# EAGLE schematic X16-Backplane (EAGLE 9.6.2)

## Sheet 1 of 2
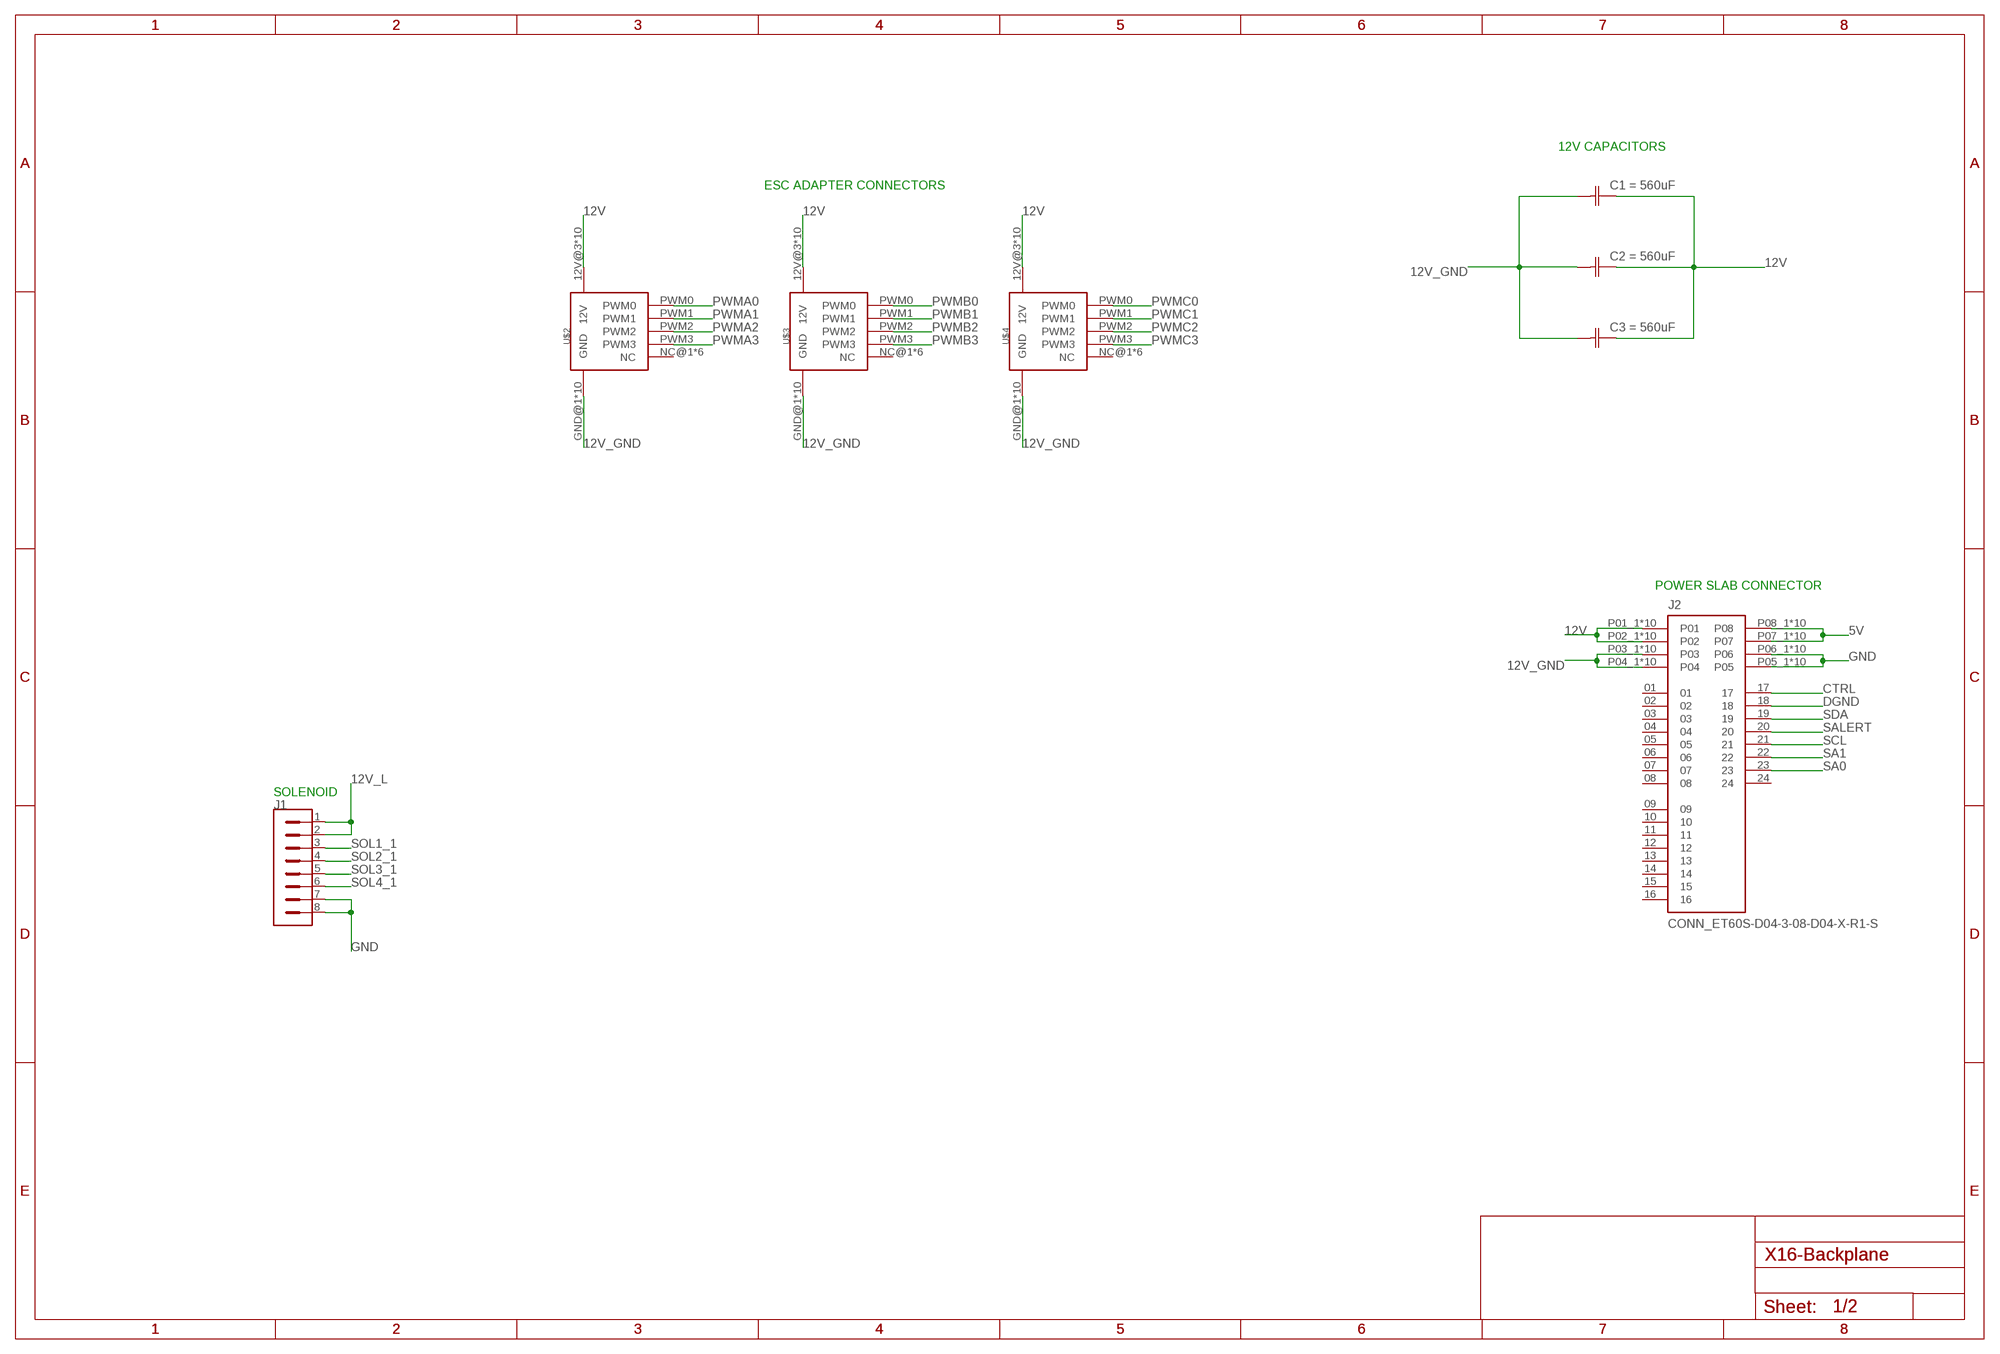
[diagram p0: schematic, sheet 1]

### Parts
C1  EEE-FT1E561UP  [CAP_FT_F_PAN]
C2  EEE-FT1E561UP  [CAP_FT_F_PAN]
C3  EEE-FT1E561UP  [CAP_FT_F_PAN]
J1  CONN_PXC-8-RA-1778683  [PXC-8-RA-1778683]
J2  CONN_ET60S-D04-3-08-D04-X-R1-S  [SAMTEC_ET60S-D04-3-08-D04-X-R1-S]
U$2  CONN_BACKPLANE_ESC_ADAPTER  [CONN_BACKPLANE_ESC_ADAPTER]
U$3  CONN_BACKPLANE_ESC_ADAPTER  [CONN_BACKPLANE_ESC_ADAPTER]
U$4  CONN_BACKPLANE_ESC_ADAPTER  [CONN_BACKPLANE_ESC_ADAPTER]

### Nets
5V: J2.P07_1(P07) J2.P07_2(P07) J2.P07_3(P07) J2.P07_4(P07) J2.P07_5(P07) J2.P07_6(P07) J2.P07_7(P07) J2.P07_8(P07) J2.P07_9(P07) J2.P07_10(P07) J2.P08_1(P08) J2.P08_2(P08) J2.P08_3(P08) J2.P08_4(P08) J2.P08_5(P08) J2.P08_6(P08) J2.P08_7(P08) J2.P08_8(P08) J2.P08_9(P08) J2.P08_10(P08) ; also sheet 2
12V: C1.1 C2.1 C3.1 J2.P01_1(P01) J2.P01_2(P01) J2.P01_3(P01) J2.P01_4(P01) J2.P01_5(P01) J2.P01_6(P01) J2.P01_7(P01) J2.P01_8(P01) J2.P01_9(P01) J2.P01_10(P01) J2.P02_1(P02) J2.P02_2(P02) J2.P02_3(P02) J2.P02_4(P02) J2.P02_5(P02) J2.P02_6(P02) J2.P02_7(P02) J2.P02_8(P02) J2.P02_9(P02) J2.P02_10(P02) U$2.12V@3(12V) U$2.12V@4(12V) U$2.12V@5(12V) U$2.12V@6(12V) U$2.12V@7(12V) U$2.12V@8(12V) U$2.12V@9(12V) U$2.12V@10(12V) U$2.12V@11(12V) U$2.12V@12(12V) U$3.12V@3(12V) U$3.12V@4(12V) U$3.12V@5(12V) U$3.12V@6(12V) U$3.12V@7(12V) U$3.12V@8(12V) U$3.12V@9(12V) U$3.12V@10(12V) U$3.12V@11(12V) U$3.12V@12(12V) U$4.12V@3(12V) U$4.12V@4(12V) U$4.12V@5(12V) U$4.12V@6(12V) U$4.12V@7(12V) U$4.12V@8(12V) U$4.12V@9(12V) U$4.12V@10(12V) U$4.12V@11(12V) U$4.12V@12(12V) ; also sheet 2
12V_GND: C1.2 C2.2 C3.2 J2.P03_1(P03) J2.P03_2(P03) J2.P03_3(P03) J2.P03_4(P03) J2.P03_5(P03) J2.P03_6(P03) J2.P03_7(P03) J2.P03_8(P03) J2.P03_9(P03) J2.P03_10(P03) J2.P04_1(P04) J2.P04_2(P04) J2.P04_3(P04) J2.P04_4(P04) J2.P04_5(P04) J2.P04_6(P04) J2.P04_7(P04) J2.P04_8(P04) J2.P04_9(P04) J2.P04_10(P04) U$2.GND@1(GND) U$2.GND@2(GND) U$2.GND@3(GND) U$2.GND@4(GND) U$2.GND@5(GND) U$2.GND@6(GND) U$2.GND@7(GND) U$2.GND@8(GND) U$2.GND@9(GND) U$2.GND@10(GND) U$3.GND@1(GND) U$3.GND@2(GND) U$3.GND@3(GND) U$3.GND@4(GND) U$3.GND@5(GND) U$3.GND@6(GND) U$3.GND@7(GND) U$3.GND@8(GND) U$3.GND@9(GND) U$3.GND@10(GND) U$4.GND@1(GND) U$4.GND@2(GND) U$4.GND@3(GND) U$4.GND@4(GND) U$4.GND@5(GND) U$4.GND@6(GND) U$4.GND@7(GND) U$4.GND@8(GND) U$4.GND@9(GND) U$4.GND@10(GND)
12V_L: J1.1 J1.2 ; also sheet 2
CTRL: J2.17 ; also sheet 2
DGND: J2.18 ; also sheet 2
GND: J1.7 J1.8 J2.P05_1(P05) J2.P05_2(P05) J2.P05_3(P05) J2.P05_4(P05) J2.P05_5(P05) J2.P05_6(P05) J2.P05_7(P05) J2.P05_8(P05) J2.P05_9(P05) J2.P05_10(P05) J2.P06_1(P06) J2.P06_2(P06) J2.P06_3(P06) J2.P06_4(P06) J2.P06_5(P06) J2.P06_6(P06) J2.P06_7(P06) J2.P06_8(P06) J2.P06_9(P06) J2.P06_10(P06) ; also sheet 2
PWMA0: U$2.PWM0 ; also sheet 2
PWMA1: U$2.PWM1 ; also sheet 2
PWMA2: U$2.PWM2 ; also sheet 2
PWMA3: U$2.PWM3 ; also sheet 2
PWMB0: U$3.PWM0 ; also sheet 2
PWMB1: U$3.PWM1 ; also sheet 2
PWMB2: U$3.PWM2 ; also sheet 2
PWMB3: U$3.PWM3 ; also sheet 2
PWMC0: U$4.PWM0 ; also sheet 2
PWMC1: U$4.PWM1 ; also sheet 2
PWMC2: U$4.PWM2 ; also sheet 2
PWMC3: U$4.PWM3 ; also sheet 2
SA0: J2.23 ; also sheet 2
SA1: J2.22 ; also sheet 2
SALERT: J2.20 ; also sheet 2
SCL: J2.21 ; also sheet 2
SDA: J2.19 ; also sheet 2
SOL1_1: J1.3 ; also sheet 2
SOL2_1: J1.4 ; also sheet 2
SOL3_1: J1.5 ; also sheet 2
SOL4_1: J1.6 ; also sheet 2
Unconnected: J2.01 J2.02 J2.03 J2.04 J2.05 J2.06 J2.07 J2.08 J2.09 J2.10 J2.11 J2.12 J2.13 J2.14 J2.15 J2.16 J2.24 U$2.NC@1(NC) U$2.NC@2(NC) U$2.NC@3(NC) U$2.NC@4(NC) U$2.NC@5(NC) U$2.NC@6(NC) U$3.NC@1(NC) U$3.NC@2(NC) U$3.NC@3(NC) U$3.NC@4(NC) U$3.NC@5(NC) U$3.NC@6(NC) U$4.NC@1(NC) U$4.NC@2(NC) U$4.NC@3(NC) U$4.NC@4(NC) U$4.NC@5(NC) U$4.NC@6(NC)

### Notes on the sheet
- 12V CAPACITORS
- ESC ADAPTER CONNECTORS
- POWER SLAB CONNECTOR
- SOLENOID

## Sheet 2 of 2
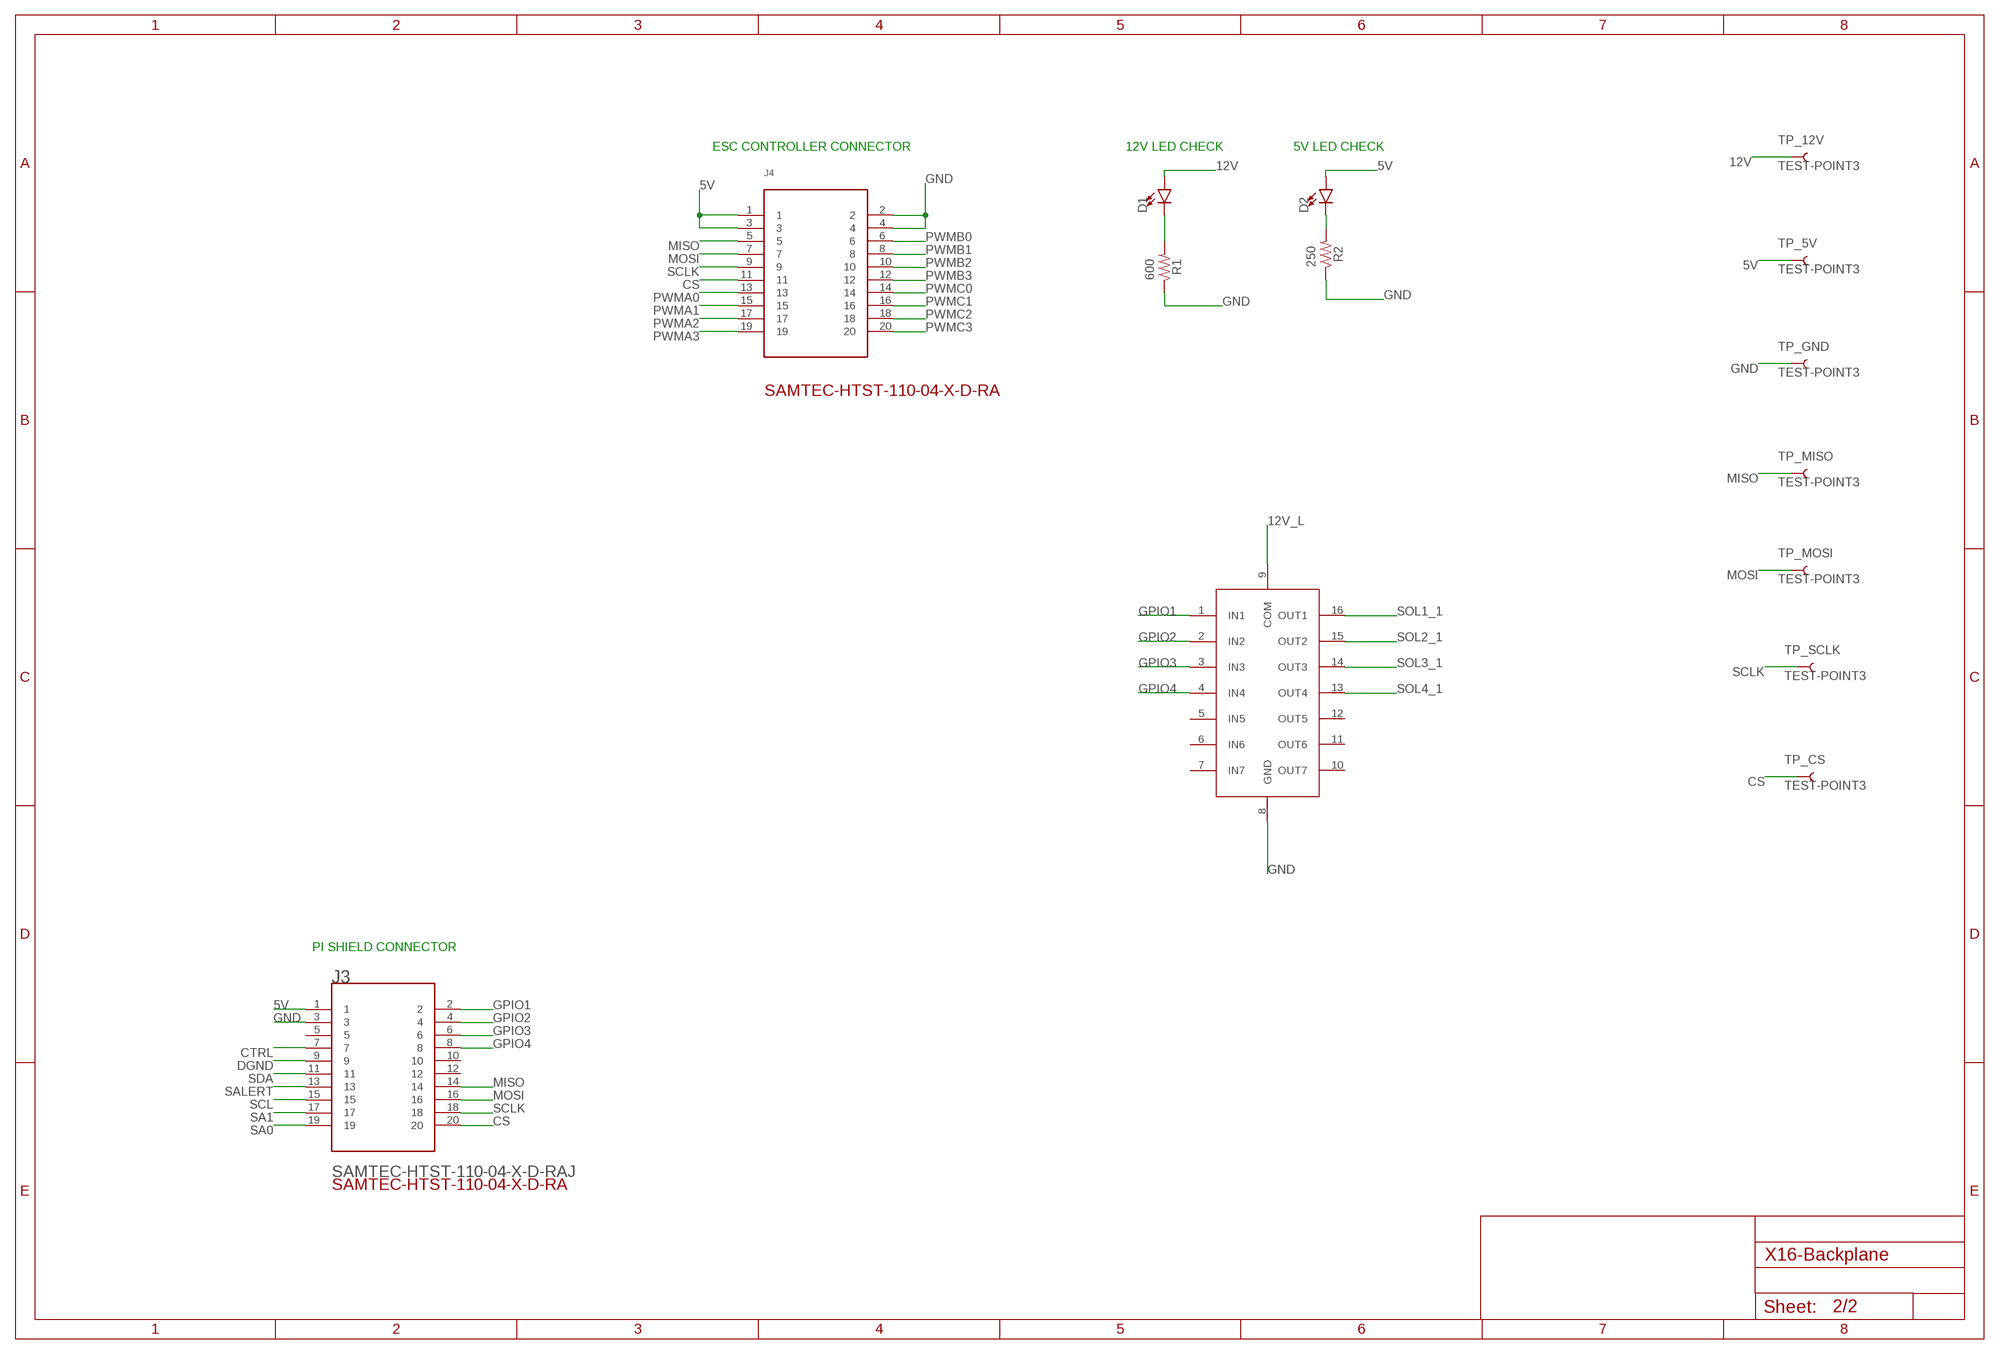
[diagram p1: schematic, sheet 2]

### Parts
D1  LED0603  [LED-0603]
D2  LED0603  [LED-0603]
J3  SAMTEC-HTST-110-04-X-D-RAJ  [SAMTEC-HTST-110-04-X-D-RA]
J4  SAMTEC-HTST-110-04-X-D-RAJ  [SAMTEC-HTST-110-04-X-D-RA]
R1  RESISTOR0603  [0603]
R2  RESISTOR0603  [0603]
TP_5V  TEST-POINT3  [PAD.03X.03]
TP_12V  TEST-POINT3  [PAD.03X.03]
TP_CS  TEST-POINT3  [PAD.03X.03]
TP_GND  TEST-POINT3  [PAD.03X.03]
TP_MISO  TEST-POINT3  [PAD.03X.03]
TP_MOSI  TEST-POINT3  [PAD.03X.03]
TP_SCLK  TEST-POINT3  [PAD.03X.03]
U1  TRANS_ULN2003AD  [16-SOIC]

### Nets
5V: D2.A J3.1 J4.1 J4.3 TP_5V.1 ; also sheet 1
12V: D1.A TP_12V.1 ; also sheet 1
12V_L: U1.9(COM) ; also sheet 1
CS: J3.20 J4.11 TP_CS.1
CTRL: J3.7 ; also sheet 1
DGND: J3.9 ; also sheet 1
GND: J3.3 J4.2 J4.4 R1.1 R2.1 TP_GND.1 U1.8(GND) ; also sheet 1
GPIO1: J3.2 U1.1(IN1)
GPIO2: J3.4 U1.2(IN2)
GPIO3: J3.6 U1.3(IN3)
GPIO4: J3.8 U1.4(IN4)
MISO: J3.14 J4.5 TP_MISO.1
MOSI: J3.16 J4.7 TP_MOSI.1
N$1: D1.C R1.2
N$5: D2.C R2.2
PWMA0: J4.13 ; also sheet 1
PWMA1: J4.15 ; also sheet 1
PWMA2: J4.17 ; also sheet 1
PWMA3: J4.19 ; also sheet 1
PWMB0: J4.6 ; also sheet 1
PWMB1: J4.8 ; also sheet 1
PWMB2: J4.10 ; also sheet 1
PWMB3: J4.12 ; also sheet 1
PWMC0: J4.14 ; also sheet 1
PWMC1: J4.16 ; also sheet 1
PWMC2: J4.18 ; also sheet 1
PWMC3: J4.20 ; also sheet 1
SA0: J3.19 ; also sheet 1
SA1: J3.17 ; also sheet 1
SALERT: J3.13 ; also sheet 1
SCL: J3.15 ; also sheet 1
SCLK: J3.18 J4.9 TP_SCLK.1
SDA: J3.11 ; also sheet 1
SOL1_1: U1.16(OUT1) ; also sheet 1
SOL2_1: U1.15(OUT2) ; also sheet 1
SOL3_1: U1.14(OUT3) ; also sheet 1
SOL4_1: U1.13(OUT4) ; also sheet 1
Unconnected: J3.5 J3.10 J3.12 U1.5(IN5) U1.6(IN6) U1.7(IN7) U1.10(OUT7) U1.11(OUT6) U1.12(OUT5)

### Notes on the sheet
- ESC CONTROLLER CONNECTOR | 12V LED CHECK | 5V LED CHECK
- PI SHIELD CONNECTOR

## Library data of the parts
C1 = X16_Backplane:EEE-FT1E561UP; C1: 560uF; COPYRIGHT: Copyright (C) 2023 Ultra Librarian. All rights reserved.; MANUFACTURER_PART_NUMBER: EEE-FT1E561UP; MFR_NAME: Panasonic
C2 = X16_Backplane:EEE-FT1E561UP; C2: 560uF; COPYRIGHT: Copyright (C) 2023 Ultra Librarian. All rights reserved.; MANUFACTURER_PART_NUMBER: EEE-FT1E561UP; MFR_NAME: Panasonic
C3 = X16_Backplane:EEE-FT1E561UP; C3: 560uF; COPYRIGHT: Copyright (C) 2023 Ultra Librarian. All rights reserved.; MANUFACTURER_PART_NUMBER: EEE-FT1E561UP; MFR_NAME: Panasonic
D1 D2 = SparkFun-LED:LED: LED (Generic) Standard schematic elements and footprints for 5mm, 3mm, 1206, and 0603 sized LEDs. Generic LEDs with no color specified.
J1 = X16_Backplane:CONN_PXC-8-RA-1778683: Backplane to Solenoid Connector
J2 = X16_Backplane:CONN_ET60S-D04-3-08-D04-X-R1-S: Backplane to Power Slab Connector: Power to the Board .100" EXTreme Ten60Power 60 Amp Signal/Power Combo Socket Strip; MANUFACTURER: Samtec; MAXIMUM_PACKAGE_HEIGHT: 10 mm; PARTREV: G; STANDARD: Manufacturer Recommendations
J3 J4 = SAMTEC-HTST-110-04-X-D-RA:SAMTEC-HTST-110-04-X-D-RA
R1 = SparkFun-Resistors:RESISTOR: Generic Resistor Package; PROD_ID: 600
R2 = SparkFun-Resistors:RESISTOR: Generic Resistor Package; PROD_ID: 250
TP_5V TP_12V TP_CS TP_GND TP_MISO TP_MOSI TP_SCLK = SparkFun-Connectors:TEST-POINT: SparkFun Test Points Bare copper test points for troubleshooting or In-Circuit-Testing. These are used by our Production team for verifying production board runs using pogo-pins on test beds. SparkFun Products: SparkFun LSM9DS1 Breakout <https://www.sparkfun.com/products/13284> SparkFun PSOC <https://www.sparkfun.com/products/13714> SparkFun Load Cell Amplifier <https://www.sparkfun.com/products/13879>
U1 = X16_Backplane:TRANS_ULN2003AD; A1_MIN: 0.25; A_MAX: 1.75; A_MIN: 1.75; A_NOM: 1.75; B_MAX: 0.51; B_MIN: 0.33; B_NOM: 0.42; D2_MAX: 0.0; D_MAX: 10.0; D_MIN: 9.8; D_NOM: 9.9; E1_MAX: 4.0; E1_MIN: 3.8; E1_NOM: 3.9; E2_MAX: 0.0; ENOM: 1.27; E_MAX: 6.2; E_MIN: 5.8; E_NOM: 6.0; L_MAX: 1.27; L_MIN: 0.38; L_NOM: 0.825; MANUFACTURER: Diodes Inc.; PIN_COUNT: 16.0; SNAPEDA_PACKAGE_ID: 27538; STANDARD: IPC 7351B
U$2-U$4 = X16_Backplane:CONN_BACKPLANE_ESC_ADAPTER: Backplane to ESC Adapter